# Altium project SRT-WREN-25-22-V101.PrjPcb
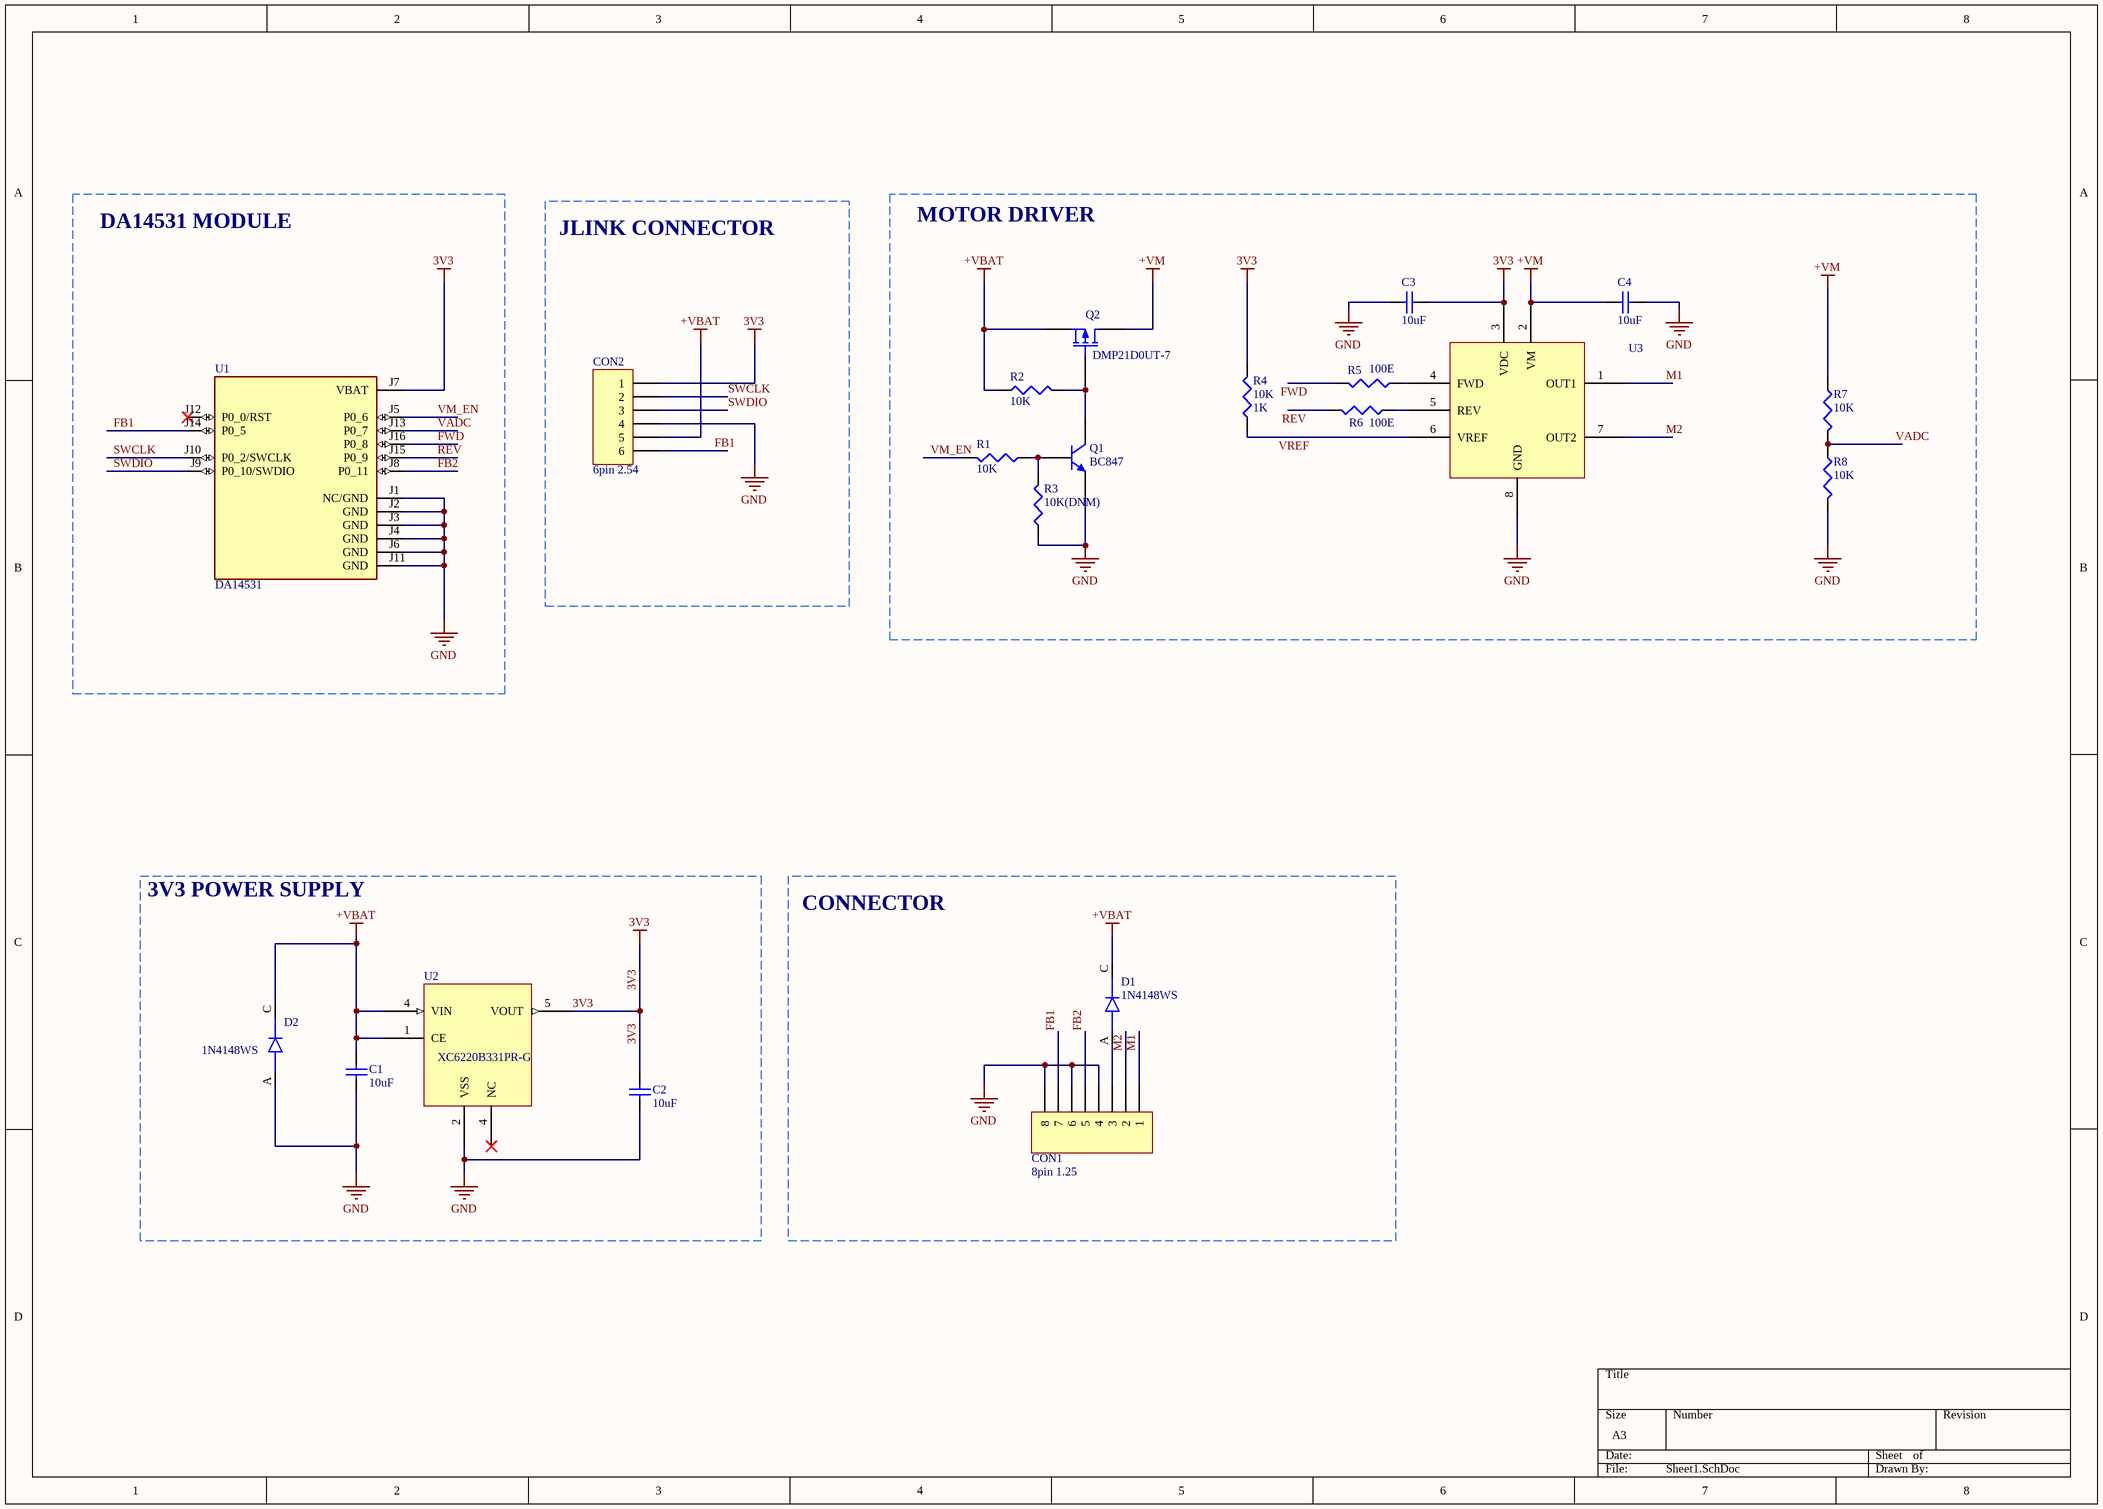
[diagram p0: Sheet1.SchDoc]
1 sheet, 21 parts. Net scope: global (net labels, ports and power ports of the same name join across sheets).
Board file: SRT-WREN-25-22-V101.PcbDoc

## Sheet Sheet1.SchDoc
size A3; SheetNumber: 3; SheetTotal: 3

### Parts
C1  10uF  [0603_C]
C2  10uF  [0603_C]
C3  10uF  [0603_C]
C4  10uF  [0603_C]
CON1  8pin 1.25  [8Pin 1.25]
CON2  6pin 2.54  [6PIN 2.54]
D1  1N4148WS  [SOD323]
D2  1N4148WS  [SOD323]
Q1  BC847  [BC846]
Q2  Q2  PN: DMP21D0UT-7  [SOT_523_P_MOS]
R1  10K  [0603_R]
R2  10K  [0603_R]
R3  10K(DNM)  [0603_R]
R4  10K  value 1K  [0603_R]
R5  100E  [0603_R]
R6  100E  [0603_R]
R7  10K  [0603_R]
R8  10K  [0603_R]
U1  DA14531  [DA14531]
U2  XC6220B331PR-G  [CONV_AL8861Y-13]
U3  ZXBM5210  [SOIC127P600X180-8N]  (value not drawn)

### Blocks framed on the sheet
DA14531 MODULE: U1
JLINK CONNECTOR: CON2
MOTOR DRIVER: C3 C4 Q1 Q2 R1-R8 U3
3V3 POWER SUPPLY: C1 C2 D2 U2
CONNECTOR: CON1 D1

### Nets
3V3: C2.2 C3.2 CON2.1 R4.2 U1.J7(VBAT) U2.5(VOUT) U3.3(VDC)
+VBAT: C1.2 CON2.5 D1.C D2.C Q2.3(S) R2.1 U2.1(CE) U2.4(VIN)
+VM: C4.2 Q2.1(D) R7.1 U3.2(VM)
GND: C1.1 C2.1 C3.1 C4.1 CON1.4 CON1.6 CON1.8 CON2.4 D2.A Q1.2(E) R3.1 R8.2 U1.J1(NC/GND) U1.J2(GND) U1.J3(GND) U1.J4(GND) U1.J6(GND) U1.J11(GND) U2.2(VSS) U3.8(GND)
FB1: CON1.7 CON2.6 U1.J14(P0_5)
FB2: CON1.5 U1.J8(P0_11)
FWD: R5.2 U1.J16(P0_8)
M1: CON1.1 U3.1(OUT1)
M2: CON1.2 U3.7(OUT2)
REV: R6.2 U1.J15(P0_9)
SWCLK: CON2.2 U1.J10(P0_2/SWCLK)
SWDIO: CON2.3 U1.J9(P0_10/SWDIO)
VADC: R7.2 R8.1 U1.J13(P0_7)
VM_EN: R1.2 U1.J5(P0_6)
VREF: R4.1 U3.6(VREF)
NetCON1_3: CON1.3 D1.A
NetQ1_1: Q1.1(C) Q2.2(G) R2.2
NetQ1_3: Q1.3(B) R1.1 R3.2
NetR5_1: R5.1 U3.4(FWD)
NetR6_1: R6.1 U3.5(REV)

Not connected (* = marked no-connect by the designer): U1 J12(P0_0/RST)*

### Library data of the parts
C1-C3 = Cap: Capacitor; MFR: KEMET; D: Multilayer Ceramic Capacitors MLCC - SMD/SMT 100V 100pF X7R 0805 5% AEC-Q200; P: 0603; PN: C0805C101J1RACAUTO; V: 10uF; URL: https://www.mouser.in/ProductDetail/KEMET/C0805C101J1RACAUTO?qs=B6kkDfuK7%2FBvhOkfk6gEhA%3D%3D
C4 = Cap: Capacitor; MFR: KEMET; V: 100pf; D: Multilayer Ceramic Capacitors MLCC - SMD/SMT 100V 100pF X7R 0805 5% AEC-Q200; P: 0603; PN: C0805C101J1RACAUTO; URL: https://www.mouser.in/ProductDetail/KEMET/C0805C101J1RACAUTO?qs=B6kkDfuK7%2FBvhOkfk6gEhA%3D%3D
D1 D2 = 1N4148W-TP: Diode Standard 100V 150mA Surface Mount SOD-123; MF: Micro Commercial; Value: *; Package: SOD-123 Microsemi; MP: 1N4148W-TP; Price: None; Availability: Unavailable; SnapEDA_Link: https://www.snapeda.com/parts/1N4148W-TP/Micro%20Commercial/view-part/232376/?ref=snap
Q1 = BC846X: MFR: Nexperia; D: Bipolar Transistors - BJT BC847/SOT23/TO-236AB; P: SOT-23; PN: BC847,215; URL: https://www.mouser.in/ProductDetail/Nexperia/BC847215?qs=me8TqzrmIYWROhdFmDauyQ%3D%3D
Q2 = PMOS: MFR: Diodes Incorporated; D: MOSFET 20V P-Ch Enh FET PD 0.24W MIN RDSon; P: SOT-523-3; URL: https://www.mouser.in/ProductDetail/Diodes-Incorporated/DMP21D0UT-7?qs=F5djdNSOT4bGXq%252B9HtekMQ%3D%3D
R1 = Res3: Resistor; D: 100R Resistor; MFR: *; P: *; PN: *; URL: *
R2-R8 = Res3: Resistor
  R2 R3 R5-R8: D: Resistor; MFR: *; P: *; PN: *; URL: *
  R4: Published: 8-Jun-2000; LatestRevisionDate: 29-May-2009; LatestRevisionNote: IPC-7351 Footprint Added.; PackageReference: J1-0603; Publisher: Altium Limited; PackageDescription: Chip Resistor
U1 = DA14531: MFR: Dialog Semiconductor; D: DA14531MOD-00F01002; P: SMD-16 Dialog Semiconductor; PN: DA14531MOD-00F0100C; URL: https://www.digikey.in/en/products/detail/dialog-semiconductor-gmbh/DA14531MOD-00F01002/11685947?s=N4IgTCBcDaICIEECMAWArAZiQWQPJwFoAGIgMSKRIgF0BfIA
U2 = Component_1: MFR: Torex Semiconductor Ltd; D: IC REG LINEAR 3.3V 1A SOT89-5; P: SOT-89-5; PN: XC6220B331PR-G; URL: https://www.digikey.in/en/products/detail/torex-semiconductor-ltd/XC6220B331PR-G/2138172; V: *